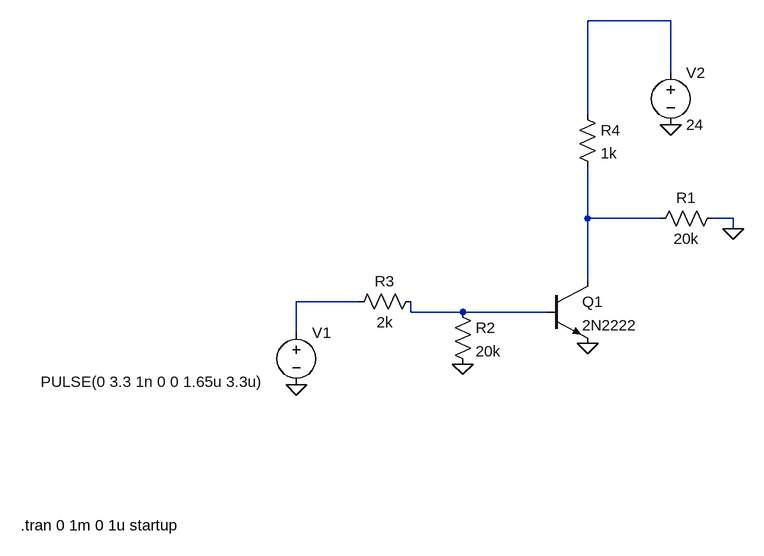
[diagram p0: schematic voltage shift.asc]
voltage shift.asc, the LTspice schematic file:
Version 4.1
SHEET 1 880 680
WIRE 368 -288 240 -288
WIRE 368 -208 368 -288
WIRE 240 -144 240 -288
WIRE 240 16 240 -64
WIRE 352 16 240 16
WIRE 464 16 432 16
WIRE 464 32 464 16
WIRE 240 112 240 16
WIRE -112 144 -208 144
WIRE -32 160 -32 144
WIRE 48 160 -32 160
WIRE 176 160 48 160
WIRE -208 192 -208 144
FLAG 368 -128 0
FLAG -208 272 0
FLAG 240 208 0
FLAG 464 32 0
FLAG 48 240 0
SYMBOL npn 176 112 R0
SYMATTR InstName Q1
SYMATTR Value 2N2222
SYMBOL voltage -208 176 R0
WINDOW 3 -393 91 Left 2
WINDOW 123 0 0 Left 0
WINDOW 39 0 0 Left 0
SYMATTR InstName V1
SYMATTR Value PULSE(0 3.3 1n 0 0 1.65u 3.3u)
SYMBOL voltage 368 -224 R0
WINDOW 123 0 0 Left 0
WINDOW 39 0 0 Left 0
SYMATTR InstName V2
SYMATTR Value 24
SYMBOL res 448 0 R90
WINDOW 0 0 56 VBottom 2
WINDOW 3 32 56 VTop 2
SYMATTR InstName R1
SYMATTR Value 20k
SYMBOL res 32 144 R0
SYMATTR InstName R2
SYMATTR Value 20k
SYMBOL res -16 128 R90
WINDOW 0 0 56 VBottom 2
WINDOW 3 32 56 VTop 2
SYMATTR InstName R3
SYMATTR Value 2k
SYMBOL res 224 -160 R0
SYMATTR InstName R4
SYMATTR Value 1k
TEXT -632 488 Left 2 !.tran 0 1m 0 1u startup

The netlist it stands for:
* voltage shift.asc
Q1 N002 N004 0 0 2N2222
V1 N003 0 PULSE(0 3.3 1n 0 0 1.65u 3.3u)
V2 N001 0 24
R1 0 N002 20k
R2 N004 0 20k
R3 N004 N003 2k
R4 N001 N002 1k
.model NPN NPN
.model PNP PNP
.lib standard.bjt
.tran 0 1m 0 1u startup
.backanno
.end